# EAGLE design FZZSHAP_REVISED (EAGLE 9.2.2)
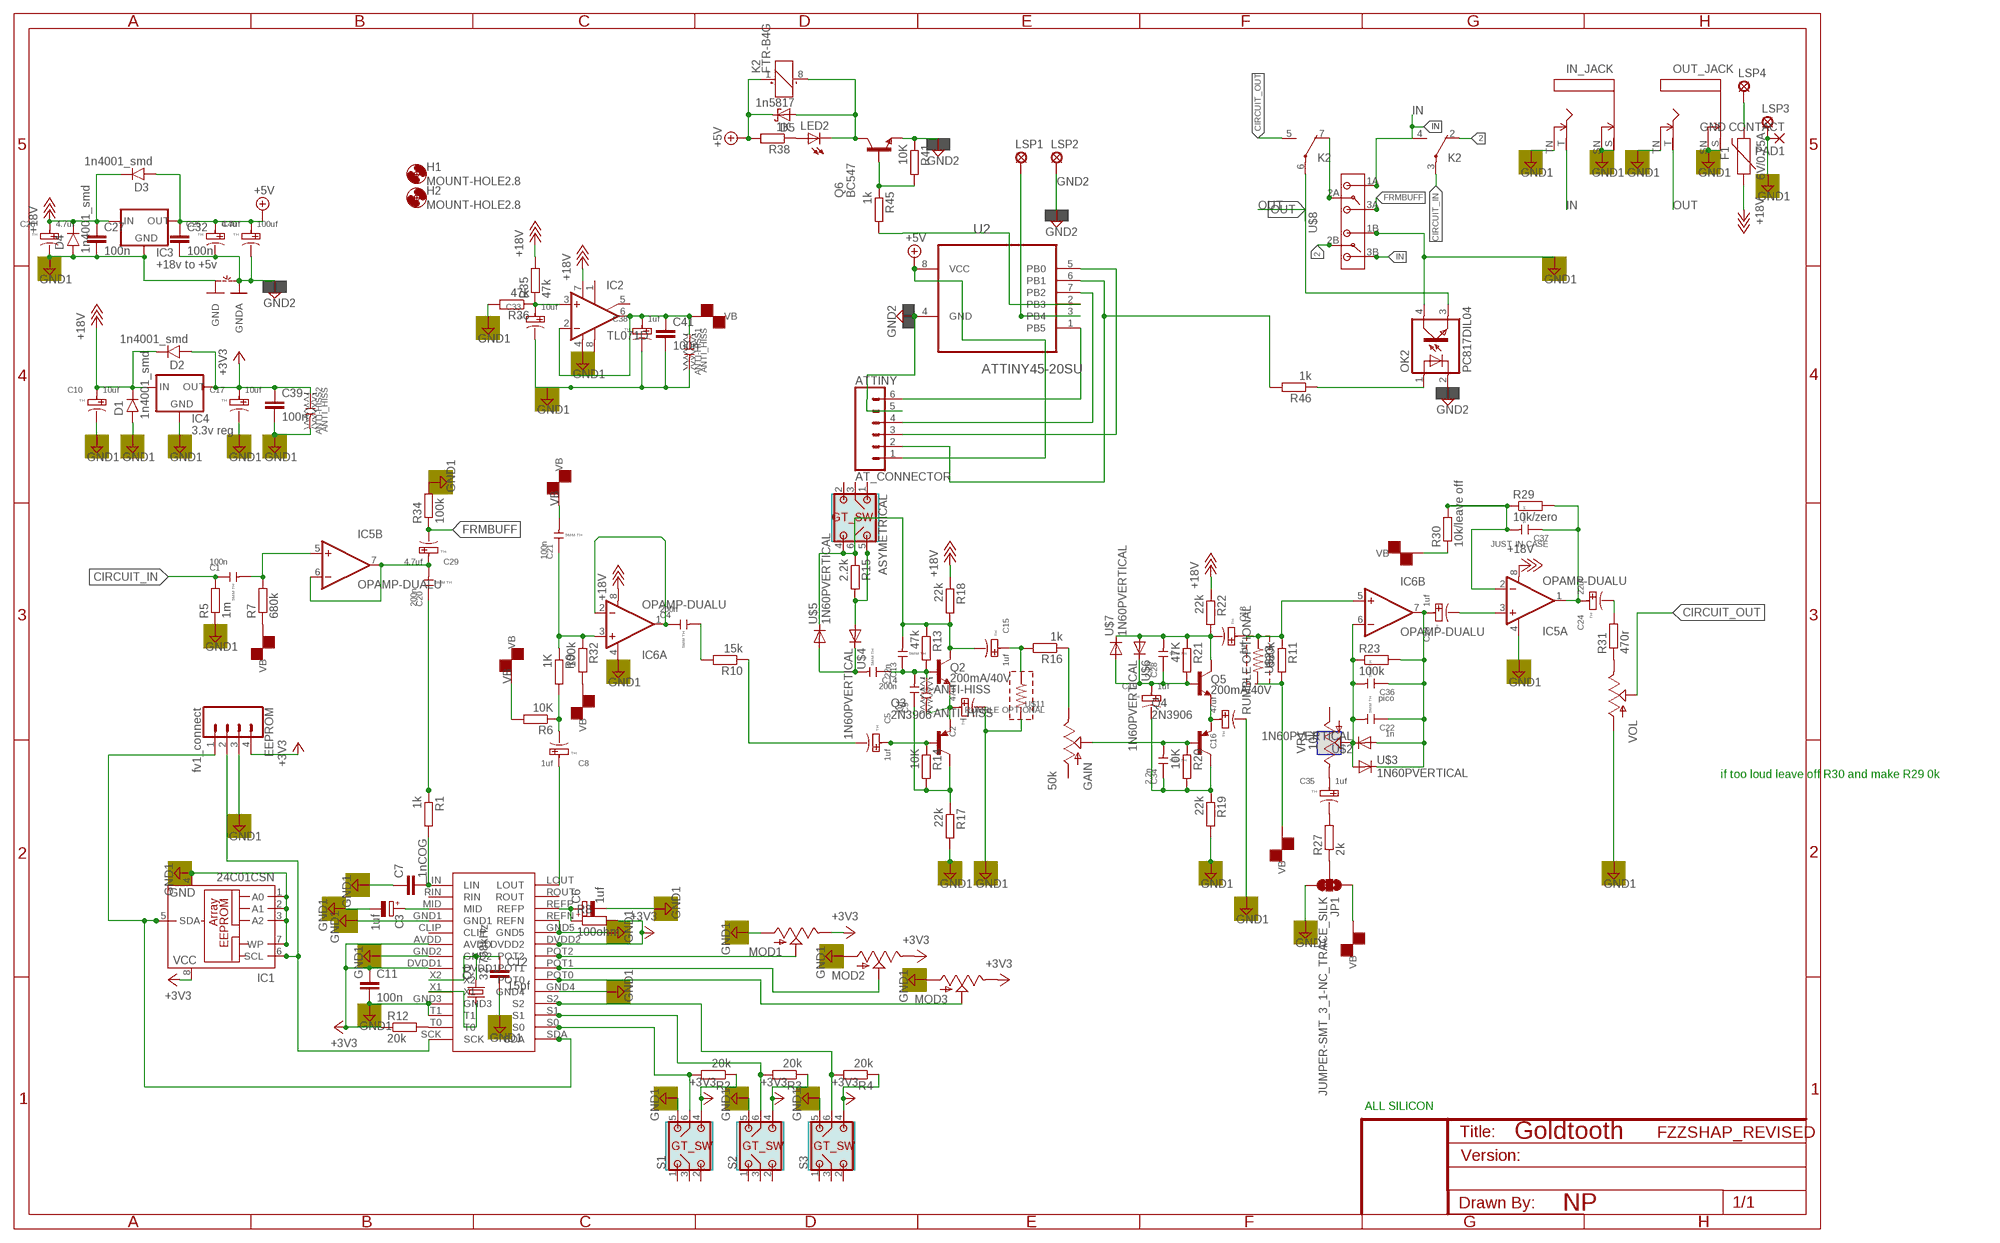
[diagram p0: schematic, sheet 1]

## Parts
ANTI-HISS  ANTI_HISS  SMDCERAMIC_1206_OPTIONAL  [SMD_OPTIONAL]
ANTI-HISS1  ANTI_HISS  SMDCERAMIC_1206_OPTIONAL  [SMD_OPTIONAL]
ANTI-HISS2  ANTI_HISS  SMDCERAMIC_1206_OPTIONAL  [SMD_OPTIONAL]
ASYMETRICAL  DP03SWPOT  [DP-03]
ATTINY  AT_CONNECTOR  CONN_06LONGPADS  [1X06_LONGPADS]
C1  100n  THRU_HOLE_5MM_SPACING  [CERAMIC-5MM]
C2  47uf  THRU-HOLE-POLARIZED  [PC-D5.3MM]
C3  1uf  CPOL-EUA/3216-18R  [A/3216-18R]
C4  200n  THRU_HOLE_5MM_SPACING  [CERAMIC-5MM]
C5  1uf  THRU-HOLE-POLARIZED  [PC-D5.3MM]
C6  1uf  CPOL-EUA/3216-18R  [A/3216-18R]
C7  1nCOG  C-EUC0805K  [C0805K]
C8  1uf  THRU-HOLE-POLARIZED  [PC-D5.3MM]
C9  1uf  THRU_HOLE_5MM_SPACING  [CERAMIC-5MM]
C10  10uf  THRU-HOLE-POLARIZED  [PC-D5.3MM]
C11  100n  C-EUC0805  [C0805]
C12  15pf  C-EUC0805  [C0805]
C13  22n  THRU_HOLE_5MM_SPACING  [CERAMIC-5MM]
C14  200n  THRU_HOLE_5MM_SPACING  [CERAMIC-5MM]
C15  1uf  THRU-HOLE-POLARIZED  [PC-D5.3MM]
C16  47uf  THRU-HOLE-POLARIZED  [PC-D5.3MM]
C17  10uf  THRU-HOLE-POLARIZED  [PC-D5.3MM]
C18  1uf  THRU-HOLE-POLARIZED  [PC-D5.3MM]
C19  1uf  THRU-HOLE-POLARIZED  [PC-D5.3MM]
C20  200n  THRU_HOLE_5MM_SPACING  [CERAMIC-5MM]
C21  100n  THRU_HOLE_5MM_SPACING  [CERAMIC-5MM]
C22  1n  THRU_HOLE_5MM_SPACING  [CERAMIC-5MM]
C23  1uf  THRU-HOLE-POLARIZED  [PC-D5.3MM]
C24  22uf  THRU-HOLE-POLARIZED  [PC-D5.3MM]
C25  4.7uf  THRU-HOLE-POLARIZED  [PC-D5.3MM]
C26  4.7uf  THRU-HOLE-POLARIZED  [PC-D5.3MM]
C27  100n  C-EUC1206  [C1206]
C28  2.2n  THRU_HOLE_5MM_SPACING  [CERAMIC-5MM]
C29  4.7uf  THRU-HOLE-POLARIZED  [PC-D5.3MM]
C32  100n  C-EUC1206  [C1206]
C33  10uf  THRU-HOLE-POLARIZED  [PC-D5.3MM]
C34  2.2n  THRU_HOLE_5MM_SPACING  [CERAMIC-5MM]
C35  1uf  THRU-HOLE-POLARIZED  [PC-D5.3MM]
C36  pico  THRU_HOLE_5MM_SPACING  [CERAMIC-5MM]
C37  JUST IN CASE  THRU_HOLE_5MM_SPACING  [CERAMIC-5MM]
C38  1uf  THRU-HOLE-POLARIZED  [PC-D5.3MM]
C39  100n  C-EUC1206  [C1206]
C40  100uf  THRU-HOLE-POLARIZED  [PC-D5.3MM]
C41  100n  C-EUC1206  [C1206]
D1  1n4001_smd  1N400X.1  [DO41-1]
D2  1n4001_smd  1N400X.1  [DO41-1]
D3  1n4001_smd  1N400X.1  [DO41-1]
D4  1n4001_smd  1N400X.1  [DO41-1]
D5  1n5817  SCHOTTKY-DIODESMD  [SMB]
EEPROM  fv1_connect  CONN_04LONGPADS  [1X04_LONGPADS]
F1  6V/0.75A  PPTC_THREE-QUARTER-AMP  [1206]
GAIN  50k  POTSLIDEY  [SLIDER_PAC]
H1  MOUNT-HOLE2.8  [2,8]
H2  MOUNT-HOLE2.8  [2,8]
IC1  24C01CSN  [SO-08]
IC2  TL071D  [SO08]
IC3  +18v to +5v  V_REG_78XX7812  [TO-252]
IC4  3.3v reg  78M33  [SOT223]
IC5  OPAMP-DUALU  [SO08]
IC6  OPAMP-DUALU  [SO08]
IN_JACK  MMMONNN  [MONO]
JP1  JUMPER-SMT_3_1-NC_TRACE_SILK  [SMT-JUMPER_3_1-NC_TRACE_SILK]
K2  FTR-B4G  [FTR-B4G]
LED2  LED3MM  [LED3MM]
LSP1  LSP10  [LSP10]
LSP2  LSP10  [LSP10]
LSP3  LSP10  [LSP10]
LSP4  LSP10  [LSP10]
MOD1  POTSLIDEY  [SLIDER_PAC]
MOD2  POTSLIDEY  [SLIDER_PAC]
MOD3  POTSLIDEY  [SLIDER_PAC]
OK2  PC817DIL04  [SMD4]
OUT_JACK  MMMONNN  [MONO]
PAD1  GND CONTACT  SMD5  [SMD2,54-5,08]
Q1  32.768kHz  CRYSTALTXC-7A  [CRYSTAL-TXC-7A]
Q2  200mA/40V  TRANS_NPN-2N3904  [TO-92]
Q3  2N3906  [TO92]
Q4  2N3906  [TO92]
Q5  200mA/40V  TRANS_NPN-2N3904  [TO-92]
Q6  BC547  [TO92]
R1  1k  R-EU_R1206  [R1206]
R2  20k  R-EU_R1206  [R1206]
R3  20k  R-EU_R1206  [R1206]
R4  20k  R-EU_R1206  [R1206]
R5  1m  R-EU_R1206  [R1206]
R6  10K  R-EU_R1206  [R1206]
R7  680k  R-EU_R1206  [R1206]
R8  100ohm  R-EU_R1206  [R1206]
R9  1K  R-EU_R1206  [R1206]
R10  15k  R-EU_R1206  [R1206]
R11  680k  R-EU_R1206  [R1206]
R12  20k  R-EU_R1206  [R1206]
R13  47k  R-EU_R1206  [R1206]
R14  10K  R-EU_R1206  [R1206]
R15  2.2k  R-EU_R1206  [R1206]
R16  1k  R-EU_R1206  [R1206]
R17  22k  R-EU_R1206  [R1206]
R18  22k  R-EU_R1206  [R1206]
R19  22k  R-EU_R1206  [R1206]
R20  10K  R-EU_R1206  [R1206]
R21  47K  R-EU_R1206  [R1206]
R22  22k  R-EU_R1206  [R1206]
R23  100k  R-EU_R1206  [R1206]
R27  2k  R-EU_R1206  [R1206]
R29  10k/zero  R-EU_R1206  [R1206]
R30  10k/leave off  R-EU_R1206  [R1206]
R31  470r  R-EU_R1206  [R1206]
R32  100k  R-EU_R1206  [R1206]
R34  100k  R-EU_R1206  [R1206]
R35  47k  R-EU_R1206  [R1206]
R36  47k  R-EU_R1206  [R1206]
R38  1K  R-EU_M1206  [M1206]
R41  10K  R-EU_M1206  [M1206]
R45  1k  R-EU_M1206  [M1206]
R46  1k  R-EU_M1206  [M1206]
S1  DP03SWPOT  [DP-03]
S2  DP03SWPOT  [DP-03]
S3  DP03SWPOT  [DP-03]
U2  ATTINY45-20SU  [SOIC127P798X216-8N]
U$1  FV-1SOIC28  [SOIC28]
U$2  1N60PVERTICAL  [DO41-1]
U$3  1N60PVERTICAL  [DO41-1]
U$4  1N60PVERTICAL  [DO41-1]
U$5  1N60PVERTICAL  [DO41-1]
U$6  1N60PVERTICAL  [DO41-1]
U$7  1N60PVERTICAL  [DO41-1]
U$8  BYSWITCH  [BUFF/TRBYPASS]
U$11  RUMBLE OPTIONAL  SMD_TOPTIONAL_RESISTOR_1206  [C1206]
U$23  RUMBLE OPTIONAL  SMD_TOPTIONAL_RESISTOR_1206  [C1206]
VOL  POTSLIDEY  [SLIDER_PAC]
VR1  10k  TRIM_US-3223G  [3223G]
~NUDEV~1  GND-GNDA1,27MM  [GND-GNDA-1,27MM]

## Nets
2: K2.2(-1:O) U$8.2B
+3V3: ANTI-HISS2.1 C11.1 C17.+ C39.1 D2.A EEPROM.4 IC1.8(VCC) IC4.3(OUT) MOD1.3(E) MOD2.3(E) MOD3.3(E) R2.1 R3.1 R4.1 R8.2 R12.1 S1.4 S2.4 S3.4 U$1.AVDD U$1.DVDD1 U$1.DVDD2
+5V: ATTINY.1 C25.+ C32.1 C40.+ D3.A D5.C IC3.2(OUT) K2.1(K:+) R38.2 U2.8(VCC)
+18V: C10.+ C26.+ C27.1 D1.C D2.C D3.C D4.C F1.1 IC2.7(V+) IC3.1(IN) IC4.1(IN) IC5.8(A:V+) IC6.8(A:V+) R18.1 R22.1 R35.2
CIRCUIT_IN: C1.1 K2.3(-1:P) R5.2
CIRCUIT_OUT: K2.5(-2:S) VOL.2(S)
FRMBUFF: C29.- R34.1 U$8.3A
FV-1_SW_1: R2.2 S1.6 U$1.S0
FV-1_SW_2: R3.2 S2.6 U$1.S1
FV-1_SW_3: R4.2 S3.6 U$1.S2
GND1: ANTI-HISS1.2 ANTI-HISS2.2 C2.- C3.- C6.- C7.1 C10.- C11.2 C12.2 C16.- C17.- C26.- C27.2 C33.- C38.- C39.2 C41.2 D1.A D4.A EEPROM.3 IC1.1(A0) IC1.2(A1) IC1.3(A2) IC1.4(GND) IC1.7(WP) IC2.4(V-) IC3.3(GND) IC4.2(GND) IC4.4(GND) IC5.4(A:V-) IC6.4(A:V-) IN_JACK.S IN_JACK.SN IN_JACK.TN JP1.3 LSP3.MP MOD1.1(A) MOD2.1(A) MOD3.1(A) OK2.4(COL) OUT_JACK.S OUT_JACK.SN OUT_JACK.TN PAD1.1(P) R5.1 R17.2 R19.2 R34.2 R36.2 S1.5 S2.5 S3.5 U$1.GND1 U$1.GND2 U$1.GND3 U$1.GND4 U$1.GND5 U$1.REFN U$1.T1 U$8.1B U$11.2 VOL.1(A) ~NUDEV~1.GND
GND2: ATTINY.5 C25.- C32.2 C40.- LSP2.MP OK2.2(C) Q6.1(E) R41.1 U2.4(GND) ~NUDEV~1.GNDA
IN: IN_JACK.T K2.4(-1:S) U$8.1A U$8.3B
LEFT_IN: C20.1 R1.1
LEFT_OUT: C8.+ U$1.LOUT
N$1: C5.+ Q3.2(B) R14.1
N$2: MOD3.2(S) U$1.POT0
N$3: C8.- R6.1 R9.2
N$4: C15.+ R16.2 U$11.1
N$5: C1.2 IC5.5(B:+IN) R7.2
N$6: C4.2 R10.2
N$7: C5.- R10.1
N$8: C21.1 IC6.3(A:+IN) R9.1 R32.1
N$10: C4.1 IC6.1(A:OUT) IC6.2(A:-IN)
N$11: ASYMETRICAL.5 R15.2 U$4.A
N$12: C37.2 IC5.2(A:-IN) R29.1 R30.2
N$13: C35.+ VR1.3(E)
N$14: MOD2.2(S) U$1.POT1
N$15: ANTI-HISS.2 C2.+ Q2.1(E) Q3.3(E)
N$16: ASYMETRICAL.4 ASYMETRICAL.6 C13.2 C15.- Q2.3(C) R13.1 R15.1 R18.2 U$5.C
N$17: GAIN.3(E) R16.1
N$18: C9.1 Q3.1(C) R14.2 R17.1
N$19: MOD1.2(S) U$1.POT2
N$21: C18.+ IC6.5(B:+IN) R11.1 U$23.1
N$22: C23.- IC5.3(A:+IN)
N$23: C22.1 C23.+ C36.1 IC6.7(B:OUT) R23.2 U$2.A U$3.C
N$24: C35.- R27.2
N$25: C16.+ Q4.3(E) Q5.1(E)
N$26: EEPROM.2 IC1.6(SCL) U$1.SCK
N$27: C24.+ C37.1 IC5.1(A:OUT) R29.2
N$28: EEPROM.1 IC1.5(SDA) U$1.SDA
N$29: C34.2 GAIN.2(S) Q4.2(B) R20.1
N$30: C7.2 R1.2 U$1.LIN
N$31: C19.+ C28.1 Q5.2(B) R21.2 U$6.C U$7.A
N$32: C14.2 U$4.C U$5.A
N$33: C3.+ U$1.MID
N$34: F1.2 LSP4.MP
N$35: C19.- C34.1 Q4.1(C) R19.1 R20.2
N$36: C24.- R31.2
N$37: JP1.2 R27.1
N$38: C22.2 C36.2 IC6.6(B:-IN) R23.1 U$2.C U$3.A VR1.2(S)
N$39: C33.+ IC2.3(+IN) R35.1 R36.1
N$40: ANTI-HISS.1 C9.2 C13.1 C14.1 Q2.2(B) R13.2
N$41: C20.2 C29.+ IC5.6(B:-IN) IC5.7(B:OUT)
N$43: R31.1 VOL.3(E)
N$46: C6.+ R8.1 U$1.REFP
N$51: C18.- C28.2 Q5.3(C) R21.1 R22.2 U$6.A U$7.C
N$52: R12.2 U$1.T0
N$53: C12.1 Q1.P$2 U$1.X2
N$54: Q1.P$1 U$1.X1
N$59: K2.7(-2:O) U$8.2A
N$74: ATTINY.3 U2.5(PB0)
N$75: ATTINY.2 R46.2 U2.6(PB1)
N$76: ATTINY.4 U2.7(PB2)
N$77: ATTINY.6 U2.1(PB5)
N$78: LED2.A R38.1
N$79: D5.A K2.8(K:-) LED2.K(C) Q6.3(C)
N$84: Q6.2(B) R41.2 R45.1
N$85: R45.2 U2.2(PB3)
N$87: LSP1.MP U2.3(PB4)
N$88: OK2.1(A) R46.1
OUT: K2.6(-2:P) OK2.3(EMIT) OUT_JACK.T
VB: ANTI-HISS1.1 C21.2 C38.+ C41.1 IC2.2(-IN) IC2.6(OUT) JP1.1 R6.2 R7.1 R11.2 R30.1 R32.2 U$23.2
Unconnected: ASYMETRICAL.1 ASYMETRICAL.2 ASYMETRICAL.3 GAIN.1(A) IC2.1(ON1) IC2.5(ON2) IC2.8(OPT) S1.1 S1.2 S1.3 S2.1 S2.2 S2.3 S3.1 S3.2 S3.3 U$1.CLIP U$1.RIN U$1.ROUT VR1.1(A)

## Notes on the sheet
- if too loud leave off R30 and make R29 0k
- ALL SILICON

## Library data of the parts
ANTI-HISS ANTI-HISS1 ANTI-HISS2 = GT_Capacitor:SMDCERAMIC_1206_OPTIONAL
ASYMETRICAL S1-S3 = switch-dil:DP03: DIL/CODE SWITCH
ATTINY = GT_Connectors:CONN_06: Multi connection point. Often used as Generic Header-pin footprint for 0.1 inch spaced/style header connections On any of the 0.1 inch spaced packages, you can populate with these: Break Away Headers - Straight <https://www.sparkfun.com/products/116> (PRT-00116) Break Away Male Headers - Right Angle <https://www.sparkfun.com/products/553> (PRT-00553) Female Headers <https://www.sparkfun.com/products/115> (PRT-00115) Break Away Headers - Machine Pin <https://www.sparkfun.com/products/117> (PRT-00117) Break Away Female Headers - Swiss Machine Pin <https://www.sparkfun.com/products/743> (PRT-00743) Arduino Stackable Header - 6 Pin <https://www.sparkfun.com/products/9280> (PRT-09280) For SCREWTERMINALS and SPRING TERMINALS visit here: Screw Terimnals on SparkFun.com <https://www.sparkfun.com/search/results?term=Screw+Terminals> (5mm/3.5mm/2.54mm spacing) This device is also useful as a general connection point to wire up your design to another part of your project. Our various solder wires solder well into these plated through hole pads. Hook-Up Wire - Assortment (Stranded, 22 AWG) <https://www.sparkfun.com/products/11375> (PRT-11375) Hook-Up Wire - Assortment (Solid Core, 22 AWG) <https://www.sparkfun.com/products/11367> (PRT-11367) View the entire wire category on our website here <https://www.sparkfun.com/categories/141>
C1 C4 C9 C13 C14 C20-C22 C28 C34 C36 C37 = GT_Capacitor:THRU_HOLE_5MM_SPACING: 302010202; PACKAGE: 5MM TH
C2 C5 C8 C10 C15-C19 C23-C26 C29 C33 C35 C38 C40 = GT_Capacitor:THRU-HOLE-POLARIZED: 302030033; PACKAGE: TH
C3 C6 = resistor:CPOL-EU: POLARIZED CAPACITOR, European symbol
C7 C11 C12 C27 C32 C39 C41 = resistor:C-EU: CAPACITOR, European symbol
D1-D4 = gm-diodes:1N400X: Rectifier Diodes often used in power supply to prevent damage from reverse polarization
D5 = diode:SCHOTTKY-DIODE: Schottky Diode
EEPROM = GT_Connectors:CONN_04: Multi connection point. Often used as Generic Header-pin footprint for 0.1 inch spaced/style header connections On any of the 0.1 inch spaced packages, you can populate with these: Break Away Headers - Straight <https://www.sparkfun.com/products/116> (PRT-00116) Break Away Male Headers - Right Angle <https://www.sparkfun.com/products/553> (PRT-00553) Female Headers <https://www.sparkfun.com/products/115> (PRT-00115) Break Away Headers - Machine Pin <https://www.sparkfun.com/products/117> (PRT-00117) Break Away Female Headers - Swiss Machine Pin <https://www.sparkfun.com/products/743> (PRT-00743) For SCREWTERMINALS and SPRING TERMINALS visit here: Screw Terimnals on SparkFun.com <https://www.sparkfun.com/search/results?term=Screw+Terminals> (5mm/3.5mm/2.54mm spacing) This device is also useful as a general connection point to wire up your design to another part of your project. Our various solder wires solder well into these plated through hole pads. Hook-Up Wire - Assortment (Stranded, 22 AWG) <https://www.sparkfun.com/products/11375> (PRT-11375) Hook-Up Wire - Assortment (Solid Core, 22 AWG) <https://www.sparkfun.com/products/11367> (PRT-11367) View the entire wire category on our website here <https://www.sparkfun.com/categories/141> Special notes: Molex polarized connector foot print use with SKU : PRT-08231 with associated crimp pins and housings. 1MM SMD Version SKU: PRT-10208; PROD_ID: CONN-09696
F1 = GOLDTOOTH-Fuses:PPTC: Resettable Fuse PPTC Resettable Fuse. Really a sort of resistor with a polymeric positive temperature coefficient whose resistance increases dramatically with an increase in temperature. When heated by the power passing through the resistance rises causing the current to be limited, protecting the circuit. This is achieved by the transition of the polymer from a crystalline to an amorphous state where the conductive carbon separates breaking the conductive pathways found in the cool crystalline structure. When a PPTC cools back down it resumes conducting letting the circuit turn back on. SparkFun Products: SparkFun RedBoard - Programmed with Arduino <https://www.sparkfun.com/products/12757> Pro Micro - 5V/16MHz <https://www.sparkfun.com/products/12640> Arduino Pro 328 - 5V/16MHz <https://www.sparkfun.com/products/10915> MP3 Trigger <https://www.sparkfun.com/products/13720>; PROD_ID: RES-11150
GAIN MOD1-MOD3 VOL = SparkFun-Electromechanical:POT
H1 H2 = holes:MOUNT-HOLE: MOUNTING HOLE with drill center marker
IC1 = microchip:24C*: Serial EEPROM 1 K/2 K/4 K; MF: MICROCHIP; MPN: 24C01C/SN; OC_FARNELL: unknown; OC_NEWARK: 96K4061
IC2 = linear:TL071: OP AMP
IC3 = SparkFun-IC-Power:V_REG_78XX: Voltage Regulator Standard 78xx regulator. IGO (Input Ground Output). Spark Fun Electronics SKU : COM-00107; PROD_ID: VREG-12370; VALUE: +12v
IC4 = v-reg-2:78M33
IC5 IC6 = SparkFun-AnalogIC:OPAMP-DUAL: Generic op-amp footprint
IN_JACK = gm-jacks2:MMMONNN; SPICEPREFIX: E
JP1 = SparkFun-Jumpers:JUMPER-SMT_3_1-NC_TRACE: Normally closed trace jumper (1 of 2 connections) This jumper has a trace between two pads so it's normally closed (NC). The other connection is normally open (NO). Use a razor knife to open the connection. For best results follow the IPC guidelines for cutting traces: Cutout at least 0.063 mm (0.005 in). Remove all loose material to clean up the cut area. Seal the cut with an approved epoxy. Reapply solder to reclose the connection, or to close the NO connection.
K2 = relay:FTR-B4: ULTRA MINIATURE RELAY 2 POLES - 2 A (Slim Profile Signal Relay) FUJITSU FTR-B4 SERIES Source: FTR-B4.pdf
LED2 = GOLDTOOTH_LED:LED: LED OSRAM: - CHIPLED LG R971, LG N971, LY N971, LG Q971, LY Q971, LO R971, LY R971 LH N974, LH R974 LS Q976, LO Q976, LY Q976 LO Q996 - Hyper CHIPLED LW Q18S LB Q993, LB Q99A, LB R99A - SideLED LS A670, LO A670, LY A670, LG A670, LP A670 LB A673, LV A673, LT A673, LW A673 LH A674 LY A675 LS A676, LA A676, LO A676, LY A676, LW A676 LS A679, LY A679, LG A679 - Hyper Micro SIDELED® LS Y876, LA Y876, LO Y876, LY Y876 LT Y87S - SmartLED LW L88C, LW L88S LB L89C, LB L89S, LG L890 LS L89K, LO L89K, LY L89K LS L896, LA L896, LO L896, LY L896 - TOPLED LS T670, LO T670, LY T670, LG T670, LP T670 LSG T670, LSP T670, LSY T670, LOP T670, LYG T670 LG T671, LOG T671, LSG T671 LB T673, LV T673, LT T673, LW T673 LH T674 LS T676, LA T676, LO T676, LY T676, LB T676, LH T676, LSB T676, LW T676 LB T67C, LV T67C, LT T67C, LS T67K, LO T67K, LY T67K, LW E67C LS E67B, LA E67B, LO E67B, LY E67B, LB E67C, LV E67C, LT E67C LW T67C LS T679, LY T679, LG T679 LS T770, LO T770, LY T770, LG T770, LP T770 LB T773, LV T773, LT T773, LW T773 LH T774 LS E675, LA E675, LY E675, LS T675 LS T776, LA T776, LO T776, LY T776, LB T776 LHGB T686 LT T68C, LB T68C - Hyper Mini TOPLED® LB M676 - Mini TOPLED Santana® LG M470 LS M47K, LO M47K, LY M47K Source: http://www.osram.convergy.de LUXEON: - LUMILED® LXK2-PW12-R00, LXK2-PW12-S00, LXK2-PW14-U00, LXK2-PW14-V00 LXK2-PM12-R00, LXK2-PM12-S00, LXK2-PM14-U00 LXK2-PE12-Q00, LXK2-PE12-R00, LXK2-PE12-S00, LXK2-PE14-T00, LXK2-PE14-U00 LXK2-PB12-K00, LXK2-PB12-L00, LXK2-PB12-M00, LXK2-PB14-N00, LXK2-PB14-P00, LXK2-PB14-Q00 LXK2-PR12-L00, LXK2-PR12-M00, LXK2-PR14-Q00, LXK2-PR14-R00 LXK2-PD12-Q00, LXK2-PD12-R00, LXK2-PD12-S00 LXK2-PH12-R00, LXK2-PH12-S00 LXK2-PL12-P00, LXK2-PL12-Q00, LXK2-PL12-R00 Source: www.luxeon.com KINGBRIGHT: KA-3528ASYC Source: www.kingbright.com
LSP1-LSP4 = solpad:LSP10: SOLDER PAD drill 1.0 mm, distributor Buerklin, 12H555
OK2 = GT_optocoupler:PC817: SHARP OPTO COUPLER
OUT_JACK = gm-jacks2:MMMONNN
PAD1 = wirepad:SMD5: SMD PAD
Q1 = SparkFun-FreqCtrl:CRYSTAL: Various standard crystals. Proven footprints. Spark Fun Electronics SKU : COM-00534
Q2 Q5 = SparkFun-DiscreteSemi:TRANS_NPN: NPN transistor Current controlled devices typically used to amplify current or used as a switch. BC547 - COM-08928 <http://www.sparkfun.com/products/8928> (TO-92 45V 100mA) (1.Collector 2.Base 3.Emitter) 2N3904 - COM-00521 <http://www.sparkfun.com/products/521> (TO-92 40V 200mA) (1.Emitter 2.Base 3.Collector) P2N2222A - COM-12852 <http://www.sparkfun.com/products/12852> (TO-92 40V 600mA) (1.Collector 2.Base 3.Emitter); PROD_ID: TRANS-08447
Q3 Q4 = transistor-pnp:2N3906: PNP Transistor
Q6 = transistor-npn:BC547*: NPN Transistor
R1-R23 R27 R29-R32 R34-R36 R38 R41 R45 R46 = resistor:R-EU_: RESISTOR, European symbol
U2 = Atmel_By_element14_Batch_1-00:ATTINY45-20SU: 8-bit Microcontroller with 4 Bytes In-System Programmable Flash; MPN: ATTINY45-20SU; OC_FARNELL: 1288353; OC_NEWARK: 23M5073; PACKAGE: SOIC-8; SUPPLIER: Atmel
U$1 = spinsemi:FV-1
U$2-U$7 = diode:1N60P
U$8 = switch-dil:BYSWITCH
U$11 U$23 = GT_Capacitor:SMD_TOPTIONAL_RESISTOR_1206
VR1 = pot:TRIM_US-: POTENTIOMETER
~NUDEV~1 = ground-junctions:GND-GNDA: Connect GND - GNDA without DRC-Error, display layer 53 (54) to make copper (ROUTE) from GND to GNDA Select also layer 53 (54) in CAM-Job!

## Board
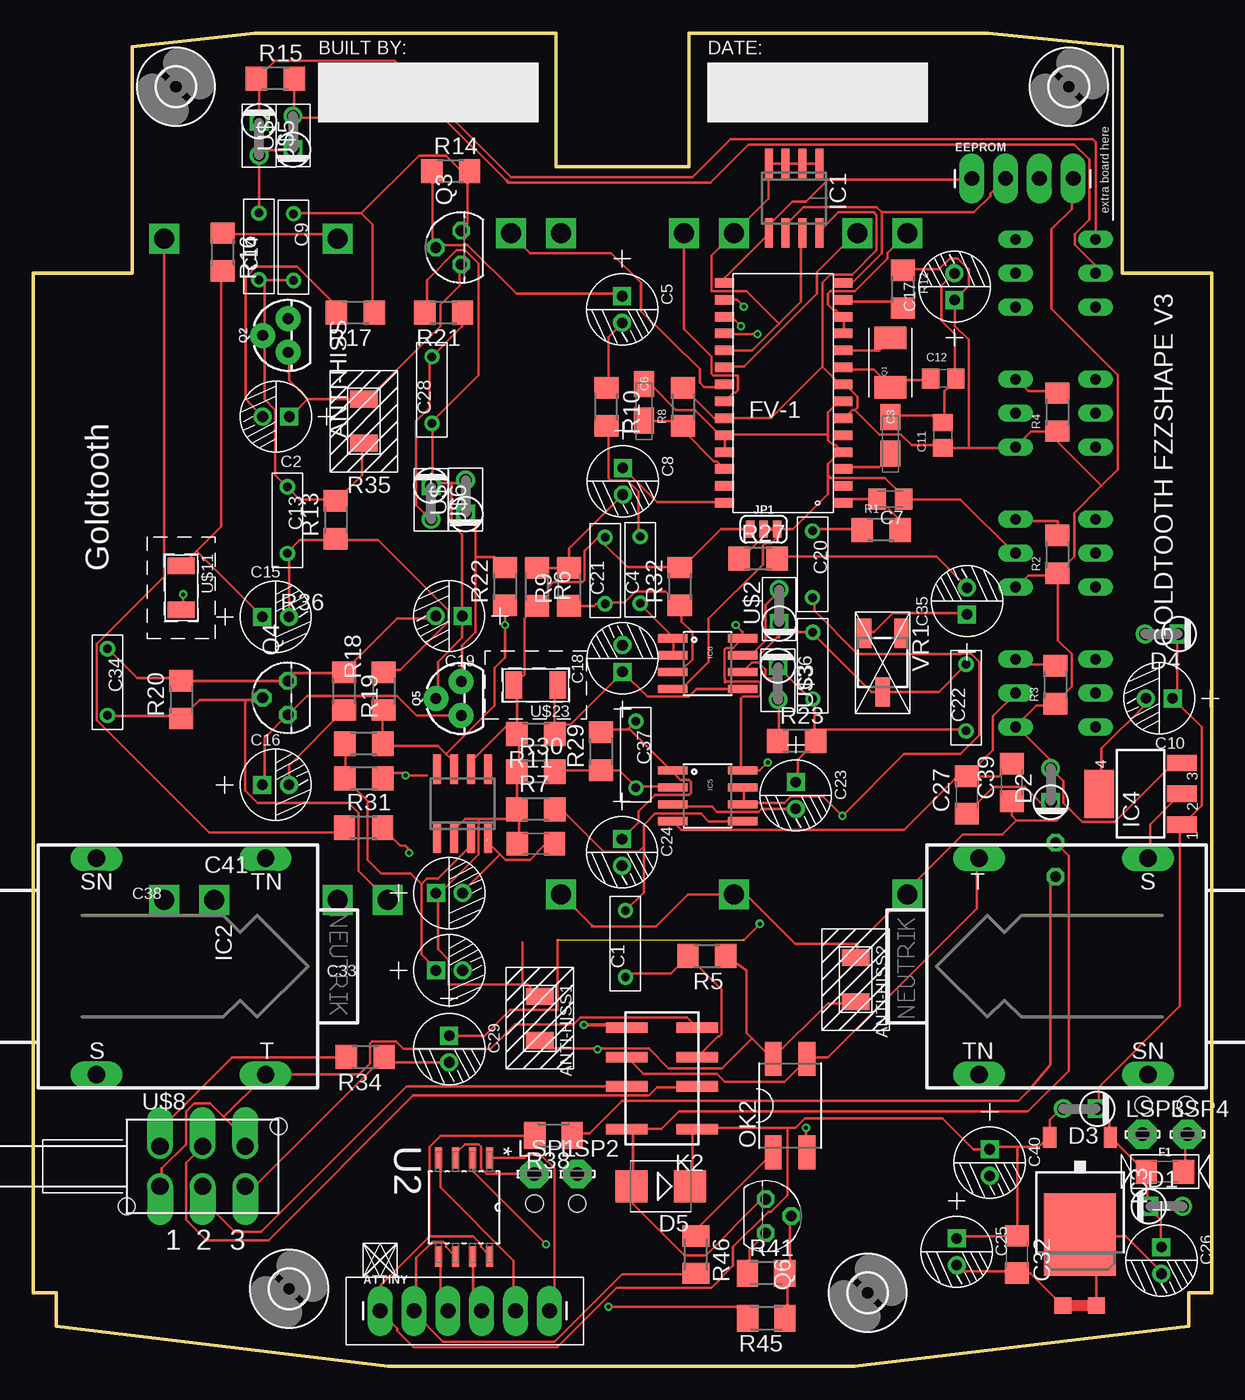
[diagram p1: board, top side]
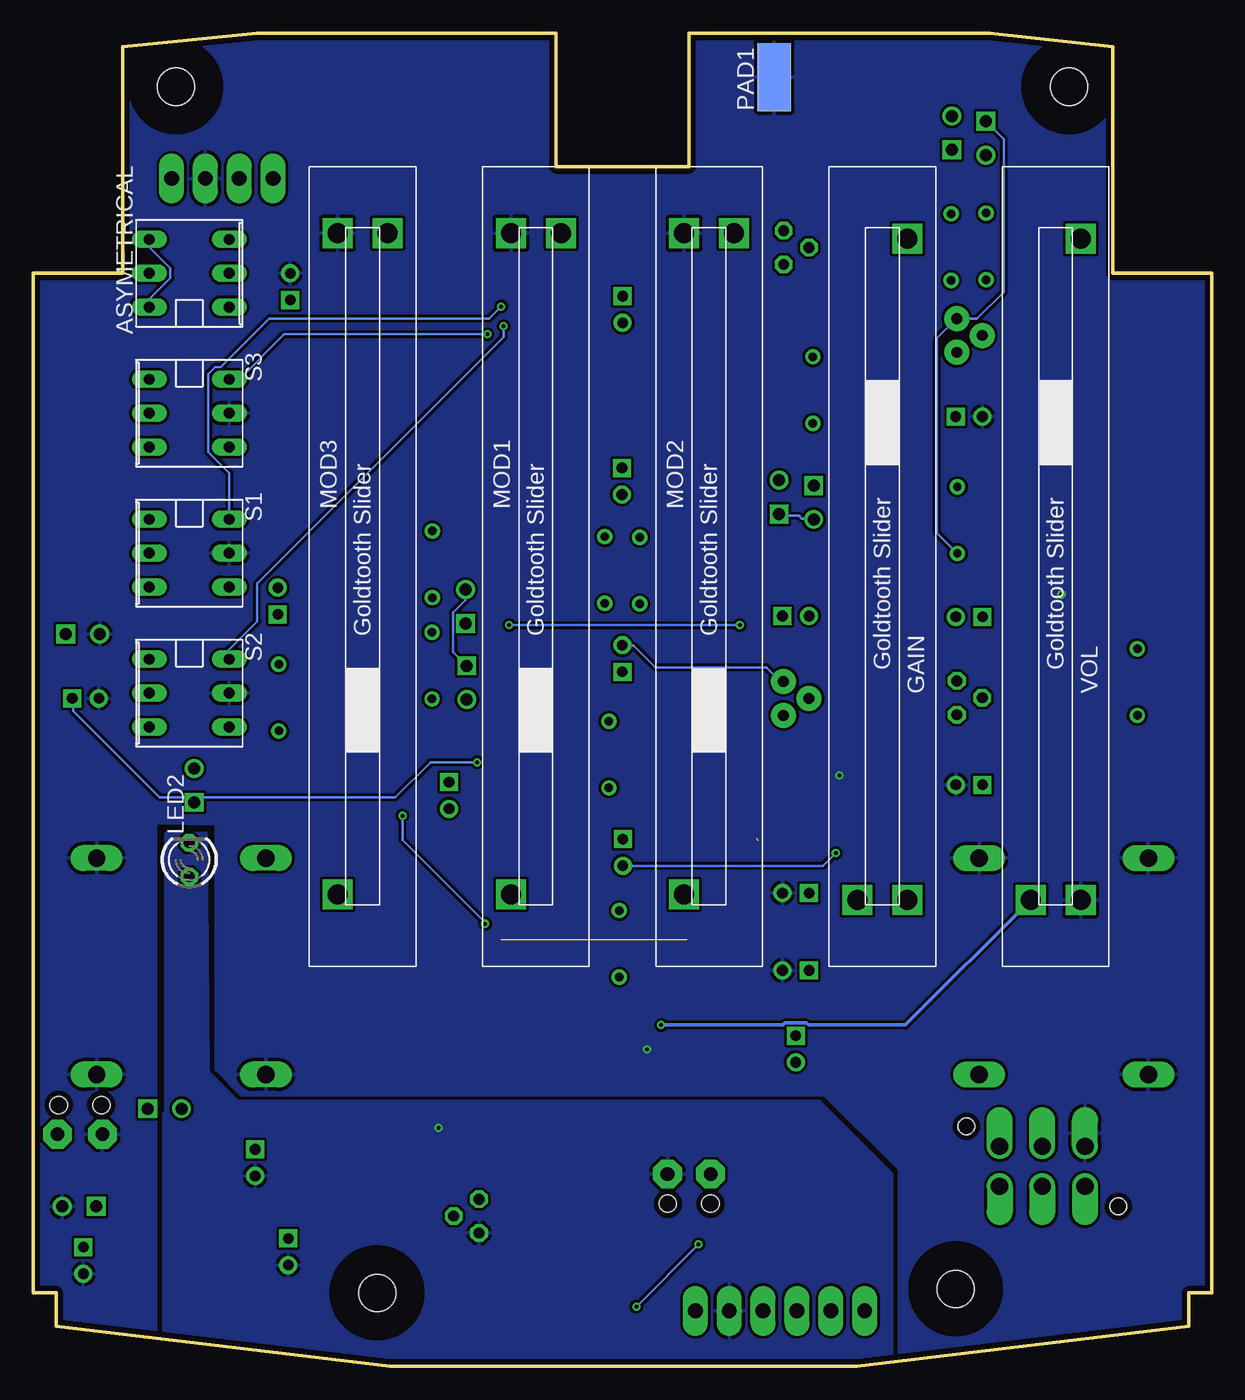
[diagram p2: board, bottom side, seen from below]

Size 88.4 x 100 mm. Coordinates in mm from the lower left corner, seen from the top.
Outline: 0,82 0,5.5 1.7,5.5 1.7,3 26.62,0 61.62,0 86.7,3 86.7,5.5 88.4,5.5 88.4,82 81.7,82 81.7,99 71.62,100 49.2,100 49.2,90 39.2,90 39.2,100 16.62,100 7.4,99 7.4,82 0,82
Copper layers (1*16): Top 0.035mm / dielectric 1.5mm / Bottom 0.035mm
Design rules "GT *": minimum track width 8mil, minimum drill 0.3mm, track to track 8mil, track to pad 6mil, pad to pad 6mil, via to via 6mil, smd to smd 0mil, copper to edge 0.4mm, drill to drill 10mil, minimum pad ring 10mil, minimum via ring 6mil, stop-mask expansion 2mil, vias tented up to drill 25mil, thermal gap 10mil

### Footprints (pad centres in the part's own frame; a part is rotated, then mirrored left to right if it is on the bottom)
SMD_OPTIONAL = smd 1.27 x 2.032: 1 -1.651,0; 2 1.651,0
DP-03 = drill 0.813 long: 1 -2.54,-3; 2 0,-3; 3 2.54,-3; 4 2.54,3; 5 0,3; 6 -2.54,3
1X06_LONGPADS = drill 1.118 pad 1.88 long: 1 0,0; 2 2.54,0; 3 5.08,0; 4 7.62,0; 5 10.16,0; 6 12.7,0
CERAMIC-5MM = drill 0.635 pad 1.143: 1 -2.5,0; 2 2.5,0
PC-D5.3MM = drill 0.8 pad 1.35 square: + -1,0 | drill 0.8 pad 1.35: - 1,0
A/3216-18R = smd 1.95 x 1.5: + 1.375,0; - -1.375,0
C0805K = smd 1.3 x 1.6: 1 -1,0; 2 1,0
C0805 = smd 1.3 x 1.5: 1 -0.95,0; 2 0.95,0
C1206 = smd 1.6 x 1.8: 1 -1.4,0; 2 1.4,0
DO41-1 = drill 0.9: A 1.27,0 | drill 0.9 square: C -1.27,0
SMB = smd 2.4 x 2.4: A 2.2,0; C -2.2,0
1X04_LONGPADS = drill 1.118 pad 1.88 long: 1 0,0; 2 2.54,0; 3 5.08,0; 4 7.62,0
1206 = smd 1.6 x 1.8: 1 -1.4,0; 2 1.4,0
SLIDER_PAC = drill 1.5 square: 1 -25,-1.875; 2 -25,1.875; 3 24.6,-1.875
2,8 = hole 2.8: 0,0
SO-08 = smd 0.6 x 2.2: 1 -1.905,-2.6; 2 -0.635,-2.6; 3 0.635,-2.6; 4 1.905,-2.6; 5 1.905,2.6; 6 0.635,2.6; 7 -0.635,2.6; 8 -1.905,2.6
SO08 = smd 0.6 x 2.2: 1 -1.905,-2.6; 2 -0.635,-2.6; 3 0.635,-2.6; 4 1.905,-2.6; 5 1.905,2.6; 6 0.635,2.6; 7 -0.635,2.6; 8 -1.905,2.6
TO-252 = smd 1 x 1.6: 1 -2.28,-4.8; 2 2.28,-4.8 | smd 5.4 x 6.2: 3 0,2.5
SOT223 = smd 1.219 x 2.235: 1 -2.311,-3.099; 2 0,-3.099; 3 2.311,-3.099 | smd 3.6 x 2.2: 4 0,3.099
SO08' = smd 0.61 x 2.21: 1 -1.905,-2.616; 2 -0.635,-2.616; 3 0.635,-2.616; 4 1.905,-2.616; 5 1.905,2.616; 6 0.635,2.616; 7 -0.635,2.616; 8 -1.905,2.616
MONO = drill 1.3 long: S 6.35,8.115; SN 6.35,-8.115; T -6.35,8.115; TN -6.35,-8.115
SMT-JUMPER_3_1-NC_TRACE_SILK = smd 0.635 x 1.27: 1 -1.016,0; 2 0,0; 3 1.016,0
FTR-B4G = smd 0.8 x 3.1: 1 -3.8,-2.65; 2 -0.6,-2.65; 3 1.6,-2.65; 4 3.8,-2.65; 5 3.8,2.65; 6 1.6,2.65; 7 -0.6,2.65; 8 -3.8,2.65
LED3MM = drill 0.813 octagon: A -1.27,0; K 1.27,0
LSP10 = drill 1.016 pad 2.159 octagon: MP 0,0
SMD4 = smd 1.27 x 2.54: 1 -1.27,-3.5; 2 1.27,-3.5; 3 1.27,3.5; 4 -1.27,3.5
SMD2,54-5,08 = smd 2.54 x 5.08: 1 0,0
CRYSTAL-TXC-7A = smd 1.7 x 2.4: P$1 1.85,0; P$2 -1.85,0
TO-92 = drill 0.813 pad 1.88: 1 -1.27,0; 2 0,1.905; 3 1.27,0
TO92 = drill 0.813 octagon: 1 1.27,0; 2 0,1.905; 3 -1.27,0
R1206 = smd 1.6 x 1.803: 1 -1.422,0; 2 1.422,0
M1206 = smd 1.6 x 2: 1 -1.4,0; 2 1.4,0
SOIC127P798X216-8N = smd 1.549 x 0.533: 1 -3.708,1.905; 2 -3.708,0.635; 3 -3.708,-0.635; 4 -3.708,-1.905; 5 3.708,-1.905; 6 3.708,-0.635; 7 3.708,0.635; 8 3.708,1.905
SOIC28 = smd 1.422 x 0.711: AVDD -4.445,1.27; CLIP -4.445,2.54; DVDD1 -4.445,-1.27; DVDD2 4.445,1.27; GND1 -4.445,3.81; GND2 -4.445,0; GND3 -4.445,-5.08; GND4 4.445,-3.81; GND5 4.445,2.54; LIN -4.445,7.62; LOUT 4.445,7.62; MID -4.445,5.08; POT0 4.445,-2.54; POT1 4.445,-1.27; POT2 4.445,0; REFN 4.445,3.81; REFP 4.445,5.08; RIN -4.445,6.35; ROUT 4.445,6.35; S0 4.445,-7.62; S1 4.445,-6.35; S2 4.445,-5.08; SCK -4.445,-8.89; SDA 4.445,-8.89; T0 -4.445,-7.62; T1 -4.445,-6.35; X1 -4.445,-3.81; X2 -4.445,-2.54
BUFF/TRBYPASS = drill 1.3 offset: 1A -3.2,-1.5; 1B -3.2,1.5; 2A 0,-1.5; 2B 0,1.5; 3A 3.2,-1.5; 3B 3.2,1.5 | hole 1.25: -5.7,-3; 5.7,3
C1206' = smd 1.27 x 2.032: 1 -1.651,0; 2 1.651,0
HOLD = hole 1.3: 0,0
3223G = smd 2.184 x 1.067: 1 -2.2,1.4; 2 2.2,0; 3 -2.2,-1.4
GND-GNDA-1,27MM = smd 1.27 x 1.27: GND -1.27,0; GNDA 1.27,0

### Placement (x,y rotation side)
ANTI-HISS  24.8,70.9 90 top
ANTI-HISS1  38,26.1 270 top
ANTI-HISS2  61.7,29 270 top
ASYMETRICAL  76.7,82 90 bottom
ATTINY  26.02,4.14 0 top
C1  44.43,31.69 90 top
C2  18.2,71.24 180 top
C3  64.31,69.85 270 top
C4  45.53,59.74 90 top
C5  44.19,79.28 270 top
C6  45.82,72.31 270 top
C7  64.31,65.06 180 top
C8  44.23,66.39 270 top
C9  19.53,83.96 270 top
C10  84.48,50.1 180 top
C11  68.24,69.85 90 top
C12  68.27,74.11 0 top
C13  19.07,63.48 270 top
C14  16.92,84.01 90 top
C15  18.18,56.23 0 top
C16  18.18,43.62 0 top
C17  69.12,80.99 90 top
C18  44.21,53.1 90 top
C19  31.2,56.28 180 top
C20  58.46,60.16 270 top
C21  42.9,59.7 90 top
C22  69.99,50.16 90 top
C23  57.21,42.81 270 top
C24  44.17,38.55 270 top
C25  69.28,8.58 270 top
C26  84.64,7.93 270 top
C27  70.04,42.85 90 top
C28  29.91,73.23 90 top
C29  31.2,23.8 270 top
C32  73.78,8.38 270 top
C33  31.2,29.7 0 top
C34  5.57,51.33 270 top
C35  70.06,57.41 90 top
C36  58.49,52.56 90 top
C37  45.21,45.89 270 top
C38  31.2,35.5 0 top
C39  73.4,43.8 90 top
C40  71.76,15.28 270 top
C41  37.7,39.2 0 top
D1  84.96,11.98 0 top
D2  76.33,43.58 90 top
D3  78.55,19.32 180 top
D4  84.69,54.94 180 top
D5  47.07,13.5 180 top
EEPROM  70.41,89.11 0 top
F1  84.9,14.6 0 top
GAIN  24.7,60 90 bottom
H1  10.7,96 0 top
H2  77.7,96 0 top
H3  MOUNT-HOLE2.8  [2,8]  62.6,5.5 0 top
H4  MOUNT-HOLE2.8  [2,8]  19.2,5.8 0 top
IC1  57.08,87.63 180 top
IC2  32.2,42.2 0 top
IC3  78.53,12.37 180 top
IC4  83.07,42.95 90 top
IC5  OPAMP-DUALU  [SO08']  50.6,42.79 270 top
IC6  OPAMP-DUALU  [SO08']  50.6,52.7 270 top
IN_JACK  11.08,30 180 top
JP1  54.8,62.8 0 top
K2  47.17,21.59 90 top
LED2  76.7,38 90 bottom
LSP1  37.59,14.42 0 top
LSP2  40.82,14.42 0 top
LSP3  83.22,17.4 0 top
LSP4  86.59,17.4 0 top
MOD1  50.7,60 270 bottom
MOD2  37.7,60 270 bottom
MOD3  63.7,60 270 bottom
OK2  56.78,19.55 0 top
OUT_JACK  77.3,30 0 top
PAD1  32.81,96.7 0 bottom
Q1  64.31,75.3 90 top
Q2  19.11,77.33 90 top
Q3  32.11,83.93 90 top
Q4  19.11,50.15 90 top
Q5  32.11,50.1 90 top
Q6  54.96,11.26 270 top
R1  63.62,62.74 0 top
R2  76.83,60.92 90 top
R3  76.68,51.12 90 top
R4  76.83,71.58 90 top
R5  50.54,30.78 180 top
R6  37.8,58.47 270 top
R7  37.7,41.78 0 top
R8  48.76,71.97 90 top
R9  40.2,58.47 90 top
R10  42.99,71.97 270 top
R11  37.7,47.42 180 top
R12  65.26,80.8 270 top
R13  22.7,63.5 90 top
R14  31.31,89.64 0 top
R15  18.16,96.61 0 top
R16  14.22,83.59 270 top
R17  24.16,79.06 180 top
R18  26.29,50.65 90 top
R19  23.33,50.65 270 top
R20  11.1,50.01 90 top
R21  30.79,79.06 180 top
R22  35.4,58.5 90 top
R23  57.28,46.9 0 top
R27  54.4,60.59 0 top
R29  42.6,46.14 90 top
R30  37.7,44.6 0 top
R31  24.78,40.4 0 top
R32  48.5,58.5 90 top
R34  24.9,23.2 180 top
R35  24.8,46.7 0 top
R36  24.8,44.1 0 top
R38  39.02,17.32 180 top
R41  54.98,6.96 0 top
R45  55,3.6 180 top
R46  49.72,8.38 270 top
S1  76.7,61 270 bottom
S2  76.7,50.5 270 bottom
S3  76.7,71.5 270 bottom
U2  32.31,11.93 270 top
U$1  56.31,72.39 180 top
U$2  55.96,56.99 90 top
U$3  55.88,51.28 270 top
U$4  19.48,92.53 90 top
U$5  16.94,92.13 270 top
U$6  29.84,64.81 270 top
U$7  32.44,65.2 90 top
U$8  12.7,15 0 top
U$11  RUMBLE OPTIONAL  [C1206']  11.1,58.4 270 top
U$17  [HOLD]  37.6,12.2 0 top
U$18  [HOLD]  40.8,12.2 0 top
U$19  [HOLD]  83.3,19.6 0 top
U$20  [HOLD]  86.5,19.6 0 top
U$23  RUMBLE OPTIONAL  [C1206']  37.7,51.1 180 top
VOL  11.7,60 90 bottom
VR1  63.73,52.79 270 top
~NUDEV~1  78.5,4.55 180 top

### Tracks (layer width: path | path; a pad name or v marks a point on that pad's centre or on a via)
2
  Top 0.203: K2.2 49.66,20.93 46.81,20.93 46.2,20.32 28.51,20.32 17.65,9.46 12.97,9.46 11.45,10.97 11.45,15.24 12.67,16.46 U$8.2B
+3V3
  Top 0.203: R12.1 65.3,82.3 67.94,82.3 68.76,83.11 69.37,83.11 70.18,82.3 70.18,81.08 69.16,80.06 C17.+ 69.16,79.86 69.16,78.03 70.18,77.01 70.18,68.89 | 70.18,68.89 73.63,68.89 S3.4 73.84,69.09 74.85,70.1 76.5,70.1 | 70.18,68.89 68.35,68.89 C11.1 68.15,69.09 65.91,69.09 65.1,69.9 63.47,69.9 61.64,71.73 | 76.5,70.1 76.68,70.1 R4.1 | R8.2 48.84,73.36 51.08,71.12 U$1.DVDD2 55.35,71.12 59.21,74.98 | 61.64,71.73 61.44,71.73 60.83,71.12 U$1.AVDD | 61.64,71.73 61.85,71.93 61.85,72.75 60.83,73.76 U$1.DVDD1 60.63,73.56 59.21,74.98 | 59.21,74.98 59.21,81.28 59.82,81.89 61.44,81.89 63.27,83.72 63.27,86.36 63.07,86.56 60.43,86.56 59,85.14 IC1.8 | 61.85,31.7 61.85,30.68 ANTI-HISS2.1 | 61.85,31.7 65.5,35.36 MOD3.3 65.58,35.73 69.75,39.91 72.71,39.91 73.76,40.95 | 61.85,31.7 57.17,31.7 53.52,35.36 52.7,35.36 MOD1.3 49.1,35.4 46.7,33 41.9,33 41.9,33.08 MOD2.3 | 77.7,41.86 77.29,42.27 77.29,43.89 76.48,44.7 D2.A 76.27,44.91 76.27,45.52 73.84,47.95 S2.4 73.84,48.16 75.26,49.58 76.48,49.58 R3.1 76.68,49.78 77.9,51 77.9,53.44 76.88,54.46 76.88,59.33 R2.1 | 77.7,41.86 78.71,40.84 81.15,40.84 85.42,45.11 86.03,45.11 IC4.3 | R2.1 76.68,59.33 74.65,59.33 73.84,58.52 S1.4 | 80.15,66.05 78.1,64.01 78.1,60.76 76.88,59.54 R2.1 | 80.15,66.05 81.35,67.26 81.35,74.37 76.4,79.33 76.4,85.31 77.9,86.81 77.9,89 EEPROM.4 | 73.76,40.95 76.79,40.95 77.7,41.86 | C39.1 73.4,41.31 73.76,40.95 | 80.15,66.05 76.5,69.7 76.5,70.1
+5V
  Top 0.203: 34.21,8.4 U2.8 34.21,8.33 33.6,8.94 33.6,9.14 32.99,9.75 29.74,9.75 | D5.C 49.45,13.61 49.45,17.48 49.66,17.68 K2.1 49.86,17.88 56.56,17.88 | C25.+ 69.37,9.75 73.63,9.75 C32.1 73.84,9.96 73.84,16.46 | D3.A 77.09,19.3 76.27,18.49 76.27,17.27 IC3.2 76.07,17.07 75.46,16.46 73.84,16.46 | 73.84,16.46 71.8,16.46 C40.+ 70.53,16.27 68.21,18.59 57.89,18.59 57.17,17.88 56.56,17.88 | 38.28,17.27 37.67,17.27 R38.2 37.46,17.27 30.55,17.27 29.74,16.46 29.74,9.75 | 29.74,9.75 26.08,6.1 26.08,4.27 ATTINY.1 26.08,4.06 27.3,2.85 27.3,2.64 28.52,1.42 39.29,1.42 43.76,5.89 50.87,5.89 52.5,7.52 52.5,8.94 55.14,11.58 55.35,11.58 56.56,12.8 56.56,17.88
+18V  (via drill 0.3)
  Top 0.203: D4.C 85.83,54.86 85.83,50.39 85.62,50.19 C10.+ 85.62,49.99 87.65,47.95 87.65,42.06 86.23,40.64 IC4.1 86.03,40.44 86.03,27.03 79.93,20.93 79.93,19.51 D3.C 79.93,19.3 80.75,18.49 80.75,17.27 IC3.1 80.95,17.07 83.39,14.63 F1.1 83.59,14.43 83.59,11.99 D1.C 83.79,11.79 84.61,10.97 84.61,8.94 C26.+ | 30.96,45.92 31.37,45.52 31.37,44.91 IC2.7 | 30.96,45.92 30.35,46.53 26.29,46.53 R35.2 26.22,49.16 R18.1 26.49,49.17 27.1,49.17 | 70.18,41.56 C27.1 | 76.27,42.27 D2.C 75.55,42.31 74.41,43.45 72.04,43.45 C27.1 | 53.31,54.66 IC6.8 | C27.1 69.98,41.56 | IC6.8 53.11,54.46 52.5,54.46 IC6.8 | 30.96,45.92 34.62,49.58 34.62,52.39 35.4,53.17 v35.4,55.6 R22.1 35.8,57.48 | 70.39,41.81 C27.1 | IC6.8 52.5,53.9 52,53.9 51.85,53.75 51.85,51.66 51.9,51.61 51.9,51.3 51.94,51.3 52,51.36 54.42,51.36 54.57,51.21 54.57,50.39 54.42,50.24 53.26,50.24 53.11,50.09 53.11,44.7 IC5.8 54.5,44.7 v55.1,45.3 | IC6.8 53.21,55.09 v52.7,55.6
  Bottom 0.203: C10.+ 85.42,49.99 85.42,49.17 78.92,42.67 76.68,42.67 76.48,42.47 D2.C | 76.07,42.67 76.27,42.47 D2.C | 76.07,42.67 61.24,42.67 58.61,45.3 v55.1,45.3 | 76.07,42.67 D2.C | v52.7,55.6 v35.4,55.6
CIRCUIT_IN
  Top 0.203: 49.05,30.89 R5.2 | 49.66,23.37 K2.3 51.37,24.74 51.48,24.74 51.62,24.89 51.62,28.27 R5.2 | 44.7,29.46 47.83,29.46 49.05,30.68 R5.2 | 44.7,29.46 44.37,29.46 | C1.1 44.7,29.46
CIRCUIT_OUT  (via drill 0.3)
  Top 0.203: 44.37,25.4 K2.5
  Top 0.254: v41.3,25.6 44.17,25.6 44.37,25.4
  Bottom 0.254: VOL.2 22.97,25.6 30.25,25.6 30.41,25.75 31.99,25.75 32.15,25.6 v41.3,25.6
FRMBUFF
  Top 0.203: U$8.3A 15.92,13.61 16.74,13.61 26.29,23.16 R34.1 26.72,22.8 C29.-
FV-1_SW_1  (via drill 0.3)
  Top 0.203: 51.69,80.06 U$1.S0 52.79,80.01 v53.3,79.5 | R2.2 76.88,62.38 76.88,63.4 73.84,63.4 S1.6
  Bottom 0.203: v53.3,79.5 54.2,78.6 70.7,78.6 74.35,74.95 74.74,74.95 75.28,74.42 75.28,68.58 73.7,67.01 S1.6
FV-1_SW_2  (via drill 0.3)
  Top 0.203: v53.11,78.03 52.5,78.64 51.89,78.64 U$1.S1 | R3.2 76.48,52.63 74.24,52.63 73.84,53.03 S2.6
  Bottom 0.203: v53.11,78.03 53.11,77.22 71.6,58.73 71.6,55.88 73.84,53.65 73.84,53.24 S2.6
FV-1_SW_3  (via drill 0.3)
  Top 0.203: v54.33,77.42 51.89,77.42 U$1.S2 | R4.2 76.68,73.15 74.65,73.15 73.84,73.97 S3.6
  Bottom 0.203: v54.33,77.42 69.57,77.42 72.82,74.17 73.63,74.17 S3.6
GND1  (via drill 0.3)  (1 unrouted)
  Top 0.203: U$1.REFN 51.89,68.68 51.89,69.7 U$1.GND5 | 60.63,68.68 60.22,69.09 60.02,69.09 59.61,69.49 59.61,69.9 | 59.61,69.9 59.61,71.53 60.63,72.54 U$1.GND2 | 59.61,66.85 59.82,66.65 63.88,66.65 65.3,65.23 C7.1 65.5,65.02 69.57,65.02 73.63,60.96 S1.5 | 59.61,66.85 59.61,67.67 60.63,68.68 | 60.63,68.68 U$1.GND1 | 59.61,69.9 51.89,69.9 U$1.GND5 | C6.- 46,73.56 46.4,73.56 48.23,71.73 49.66,71.73 51.69,69.7 U$1.GND5 | 59.61,66.85 59.61,65.43 57.79,63.61 57.44,63.26 56.98,62.8 JP1.3 | 53.92,24.59 55.35,23.16 OK2.4 55.55,23.16 59.61,27.23 61.64,27.23 ANTI-HISS2.2 | 53.92,24.59 53.49,25.02 53.49,29.68 R5.1 51.89,30.89 | 53.92,24.59 51.69,22.35 47.67,22.35 46.18,23.84 42.34,23.84 | U$1.GND4 53.92,76.2 55.95,78.23 | 55.95,78.23 57.58,79.86 57.58,84.94 IC1.7 | 26.29,44.09 R36.2 26.29,44.3 26.49,44.5 27.92,44.5 v27.92,44.3 29.54,44.3 | 68.35,71.32 68.35,73.15 69.16,73.97 C12.2 69.16,74.17 69.16,77.42 68.15,78.44 68.15,81.08 68.96,81.89 C17.- | 68.35,71.32 68.35,70.92 C11.2 68.35,71.32 | 68.35,71.32 64.49,71.32 C3.- | 34.01,39.42 35.03,38.41 | 35.03,38.41 35.43,38 37.26,38 38.28,39.01 39.09,39.01 C41.2 39.29,39.01 | IC1.1 58.8,90.22 57.78,90.22 IC1.2 57.58,90.22 56.56,90.22 IC1.3 56.36,90.22 55.35,90.22 IC1.4 55.14,90.22 55.14,87.58 52.7,85.14 MOD1.1 52.5,84.94 50.87,83.31 50.87,80.67 53.52,80.67 55.95,78.23 | U$1.GND3 60.83,77.62 60.83,78.64 U$1.T1 60.63,78.84 60.22,79.25 60.02,79.25 59.61,79.65 59.61,80.47 59.82,80.67 61.64,80.67 64.08,83.11 64.08,83.52 65.5,84.94 MOD3.1 | 70.18,44.41 C27.2 | S2.5 73.63,50.39 72.01,48.77 72.01,46.22 C27.2 | R34.2 23.44,23.16 14.91,23.16 9.62,17.88 9.62,16.66 U$8.1B
  Top 0.203: 23.24,49.38 R19.2 19.18,45.07 19.18,43.48 C16.- | R17.2 22.63,79.25 22.63,79.65 19.79,82.5 16.74,82.5 15.92,81.69 15.92,72.54 17.14,71.32 C2.- | v11.25,57.91 11.25,56.9 U$11.2 | IC4.2 86.03,42.88 83.79,40.64 83.79,38.2 OUT_JACK.S | IC4.4 80.14,43.08 80.14,46.33 83.39,49.58 83.39,49.99 C10.- | 35.03,38.41 32.18,35.56 C38.- | 78.71,9.75 81.96,9.75 84.61,7.11 C26.- | 78.71,9.75 IC3.3 79.5,8.9 | ~NUDEV~1.GND 79.77,8.7 78.71,9.75 | ANTI-HISS1.2 38.61,23.84 42.34,23.84 | 48.03,50.8 IC6.4 48.64,50.8 50.67,52.83 50.67,56.08 54.73,60.15 54.73,61.57 54.94,61.77 55.35,61.77 55.82,62.24 JP1.3 | v42.34,23.77 42.34,23.84 | IC5.4 48.63,40.23 65.3,40.23 69.32,44.26 C27.2 | JP1.3 55.82,63.23 | C27.2 72.45,44.26 C39.2
  pour Bottom: 23.46,-0.5 23.46,14.73 29.03,20.3 72.8,20.3 74.73,22.23 74.73,40.64 76.84,40.64 76.9,40.7 79.17,40.64 79.17,0 90.34,0 90.34,97.86 87.2,101 2.7,101 -1.8,96.5 -1.8,3.5 2.2,-0.5
GND2  (via drill 0.3)
  Top 0.203: 30.35,15.72 U2.4 30.55,15.44 30.55,13.41 36.04,7.92 36.04,4.27 ATTINY.5 | v57.99,17.88 57.99,16.05 OK2.2 | C25.- 69.37,7.52 69.77,7.11 73.63,7.11 C32.2 74.8,6.99 ~NUDEV~1.GNDA | R41.1 53.72,7.11 53.72,8.74 54.94,9.96 Q6.1
  pour Bottom: 78.7,19 78.7,-0.5 23.96,-0.5 23.96,14.46 29.4,19.9 73.04,19.9 75.22,22.07 75.36,40.01 78.53,40.01 78.53,19
IN
  Top 0.203: 14.3,18.69 15.72,17.27 15.72,16.66 U$8.3B | 14.3,18.69 13.28,19.71 12.06,19.71 11.45,19.1 11.45,16.66 9.62,14.83 9.62,13.61 U$8.1A | 14.3,18.69 17.35,21.74 IN_JACK.T 24.43,21.89 25.27,22.72 25.27,24.21 25.42,24.36 27.23,24.36 27.78,23.8 34.32,23.8 36.15,25.63 40.55,25.63 41.07,26.16 49.05,26.16 K2.4
LEFT_IN
  Top 0.203: R1.1 62.05,62.79 58.6,62.79 C20.1
LEFT_OUT
  Top 0.203: U$1.LOUT 51.69,64.82 46.81,64.82 44.37,67.26 C8.+
N$1
  Top 0.203: R14.1 29.95,89.61 29.95,84.33 30.15,84.12 Q3.2 30.35,84.12 32.59,84.12 36.24,80.47 44.17,80.47 C5.+
N$2
  Top 0.203: U$1.POT0 51.89,74.98 53.31,74.98 58.8,80.47 58.8,82.09 61.64,84.94 MOD3.2
N$3
  Top 0.203: 37.84,59.95 R6.1 R9.2 | R9.2 40.1,60.35 | R9.2 40.2,61.36 C8.-
N$4
  Top 0.203: 12.27,61.16 11.25,60.15 U$11.1 | 12.27,61.16 14.09,62.99 14.09,82.09 R16.2 | 12.27,61.16 17.14,56.29 C15.+
N$5
  Top 0.203: 39.29,41.25 39.29,41.45 | 39.29,41.45 39.29,41.66 R7.2 39.29,41.45 | IC5.5 50.67,40.88 50.1,41.45 46.65,41.45 45.8,40.6 45.8,39.1 45.8,39 | 45.8,39 45.4,38.6 42.8,38.6 39.95,41.45 39.29,41.45 | C1.2 45.8,35.56 45.8,39
N$6
  Top 0.203: R10.2 43.15,70.51 43.15,66.65 43.36,66.45 44.58,66.45 45.39,65.63 45.39,62.38 C4.2
N$7
  Top 0.203: R10.1 43.15,73.56 43.15,77.22 44.17,78.23 C5.-
N$8
  Top 0.203: IC6.3 48.03,52.22 48.64,52.22 49.45,53.03 49.45,55.07 48.64,55.88 48.64,56.9 R32.1 48.44,57.1 47.42,58.12 45.19,58.12 44.37,57.3 42.95,57.3 42.9,57.25 C21.1 42.23,57.2 42.08,57.05 R9.1
N$10
  Top 0.203: IC6.2 48.03,53.44 48.03,54.46 IC6.1 48.03,54.66 45.59,57.1 C4.1
N$11
  Top 0.203: R15.2 19.58,96.52 19.58,93.88 U$4.A 19.58,93.67 30.76,93.67 35.47,88.97 | 35.47,88.97 35.63,88.8 | 35.47,88.97 35.5,88.97 35.67,88.8 50.8,88.8 53.64,91.64 78.12,91.64 79.22,90.54 79.22,86.02 78.12,84.92 78.12,84.16 79.7,82.59 ASYMETRICAL.5
N$12
  Top 0.203: R30.2 39.29,44.7 42.54,44.7 R29.1 42.75,44.7 43.97,44.7 45.19,43.48 C37.2 45.39,43.48 47.83,43.48 IC5.2
N$13
  Top 0.203: VR1.3 62.46,55.07 63.07,55.07 64.49,56.49 69.98,56.49 C35.+
N$14
  Top 0.203: U$1.POT1 51.67,73.47 50.33,73.47 50,73.8 50,74.8 45.59,79.15 45.59,81.28 43.36,83.52 37.26,83.52 35.84,84.94 MOD2.2
N$15
  Top 0.203: 20.6,72.54 24.66,72.54 ANTI-HISS.2 24.86,72.75 25.27,72.75 30.55,78.03 30.55,79.65 31.98,81.08 31.98,82.5 Q3.3 | 20.6,72.54 19.38,71.32 C2.+ | 20.6,72.54 19.18,73.97 19.18,76 Q2.1
N$16
  Top 0.203: R18.2 26.49,52.22 27.51,52.22 31.16,55.88 31.16,56.69 25.88,61.98 22.83,61.98 R13.1 22.63,61.98 19.99,61.98 19.18,61.16 C13.2 19.18,60.96 19.18,56.29 C15.- | 16.94,93.27 U$5.C 16.94,96.52 R15.1 16.82,96.61 18.16,97.94 27.1,97.94 35.84,89.2 49.45,89.2 52.3,92.05 79.5,92.05 79.7,91.85 ASYMETRICAL.4
  Bottom 0.203: ASYMETRICAL.6 79.7,80.05 78.12,81.62 78.12,82.38 79.7,83.95 ASYMETRICAL.4 | C13.2 20.6,62.51 20.6,76.8 20.6,76.9 20.6,77.11 Q2.3 17.59,78.61 15.6,80.6 15.6,92.06 U$5.C
N$17
  Top 0.203: R16.1 14.3,84.94 22.43,84.94 22.63,84.73 GAIN.3
N$18
  Top 0.203: Q3.1 32.18,85.34 32.59,85.75 32.59,89.61 R14.2 32.59,89.81 31.98,89.81 30.96,90.83 28.93,90.83 24.6,86.5 | R17.1 25.47,79.25 25.47,85.1 25.47,85.34 25.47,85.63 24.6,86.5 | C9.1 19.57,86.5 24.6,86.5
N$19
  Top 0.203: 51.69,72.54 U$1.POT2 52.53,73.05 52.68,73.05 52.88,73.25 52.88,74.32 51.05,74.32 50.9,74.47 50.9,75.74 48.83,77.81 MOD1.2
N$21
  Top 0.203: 39.09,48.16 39.09,47.55 R11.1 | IC6.5 53.11,50.8 49.75,50.8 49.19,50.24 46.06,50.24 C18.+ | 44.37,52.02 C18.+ | 39.09,48.16 40.31,48.16 44.17,52.02 C18.+ | 39.09,48.16 R11.1 | R11.1 39.12,50.87 U$23.1
N$22
  Top 0.203: 48.03,42.27 IC5.3 48.13,42 50.9,42 51.3,41.6 54.42,41.6 54.64,41.81 C23.-
N$23
  Top 0.203: 53.11,53.44 IC6.7 | 58.6,47.75 58.6,49.99 C36.1 58.39,49.99 55.95,52.43 U$3.C | 58.6,47.75 58.6,46.94 R23.2 | 58.6,47.75 69.98,47.75 C22.1 | 58.6,47.75 R23.2 | C23.+ 57.38,43.89 57.38,45.52 58.6,46.74 R23.2 | 52.5,53.24 53.11,53.24 IC6.7 | IC6.7 53.31,53.44 53.92,53.44 54.94,54.46 54.94,57.1 55.95,58.12 U$2.A
  Bottom 0.203: U$2.A 55.96,57.49 56.92,56.53 56.92,53.59 U$3.C
N$24
  Top 0.203: C35.- 69.98,58.52 67.77,60.73 55.96,60.73 R27.2
N$25
  Top 0.203: C16.+ 17.35,43.69 17.35,47.14 18.97,48.77 Q4.3 19.11,48.87 19.12,48.85 20.55,50.28 27.3,50.28 28.75,48.83 Q5.1
N$26
  Top 0.203: U$1.SCK 61.44,81.28 63.68,83.52 63.68,86.56 | 63.68,86.56 63.27,86.97 57.78,86.97 56.56,85.75 56.56,85.14 IC1.6 | 63.68,86.56 70.59,86.56 71.8,87.78 71.8,87.99 72.82,89 EEPROM.2
N$27
  Top 0.203: 44.58,47.75 42.75,47.75 R29.2 | 44.58,47.75 45.19,48.36 C37.1 | 47.83,44.7 44.78,47.75 44.58,47.75 | 47.83,44.7 IC5.1 | 47.83,44.7 48.55,43.98 49.19,43.98 49.34,43.84 49.34,43.02 49.19,42.87 46.64,42.87 45.39,41.62 45.39,40.78 C24.+
N$28
  Top 0.203: U$1.SDA 51.89,81.28 51.89,81.69 55.14,84.94 IC1.5 55.35,85.14 55.35,85.75 56.97,87.38 57.99,87.38 59.61,89 70.38,89 EEPROM.1
N$29
  Top 0.203: C34.2 5.76,48.77 11.05,48.77 R20.1 11.25,48.77 12.47,49.99 15.9,49.99 | 15.9,49.99 17.14,49.99 Q4.2 | 15.9,49.99 15.9,43.19 16.84,42.25 23.65,42.25 24.41,41.49 24.41,37.16 GAIN.2
N$30
  Top 0.203: U$1.LIN 60.83,64.82 61.07,65.06 C7.2 | 63.27,65.23 C7.2 | R1.2 64.89,62.79 64.89,63.6 63.47,65.02 C7.2
N$31
  Top 0.203: Q5.2 30.35,50.19 30.35,52.83 32.18,54.66 32.18,56.08 C19.+ 32.18,56.29 32.18,62.38 31.37,63.2 31.37,66.24 | 31.37,66.24 32.18,66.24 32.38,66.45 U$7.A | 31.37,66.24 29.95,66.24 | R21.2 29.54,79.25 29.54,81.48 31.77,83.72 32.38,83.72 33.4,82.7 33.4,74.37 29.95,70.92 C28.1 29.95,70.71 29.95,66.24 | 29.95,66.24 U$6.C
N$32
  Top 0.203: C14.2 16.94,86.56 U$5.A 16.94,91.03 17.14,91.24 19.38,91.24 U$4.C
N$33
  Top 0.203: U$1.MID 60.83,67.46 63.47,67.46 64.29,68.28 C3.+
N$34
  Top 0.203: F1.2 86.43,14.63 86.43,17.38 LSP4.MP
N$35
  Top 0.203: C34.1 5.76,53.65 7.8,51.61 11.05,51.61 R20.2 11.25,51.41 18.97,51.41 Q4.1 19.18,51.61 19.58,52.02 23.24,52.02 R19.1 23.44,52.22 27.3,56.08 30.15,56.08 C19.-
N$36  (via drill 0.3)
  Top 0.203: R31.2 27.52,39.08 27.91,39.01 28.2,38.73 v28.2,38.5
  Bottom 0.203: v28.2,38.5 29.15,37.55 C24.-
N$37
  Top 0.203: 52.67,60.88 R27.1 53.09,60.59 54.8,62.3 JP1.2
N$38
  Top 0.203: C22.2 69.98,52.63 67.94,50.6 63.88,50.6 VR1.2 63.68,50.6 62.86,50.6 58.6,54.86 C36.2 58.39,55.07 56.77,55.07 56.16,55.68 U$2.C 55.96,54.67 55.81,54.67 54.57,53.43 54.57,52.93 54.42,52.78 | R23.1 55.95,46.94 55.95,49.99 U$3.A 55.88,51.32 55.8,51.4 55.61,51.59 55.07,51.59 54.92,51.74 54.92,52.28 54.42,52.78 | 53.31,52.02 IC6.6 53.92,52.78 54.42,52.78
N$39
  Top 0.203: R35.1 23.44,46.53 23.44,44.3 R36.1 25.07,42.41 25.07,38 26.08,36.98 28.32,36.98 29.13,36.17 | 29.13,36.17 29.54,36.58 30.35,36.58 32.79,39.01 32.79,39.42 IC2.3 | 29.13,36.17 29.13,30.89 30.15,29.87 C33.+
N$40
  Top 0.203: 17.35,81.48 16.94,81.48 C14.1 17.35,81.48 | 17.35,81.48 19.38,81.48 C9.2 | 17.35,81.48 17.35,77.42 Q2.2 17.35,77.22 17.35,72.54 18.16,71.73 18.16,66.85 18.97,66.04 C13.1 19.18,65.84 19.99,65.02 22.63,65.02 R13.2 22.83,65.02 24.66,66.85 24.66,69.09 ANTI-HISS.1
N$41  (via drill 0.3)  (1 unrouted)
  Top 0.203: C29.+ 33.84,24.8 35.78,26.74 39.34,26.74 39.34,31.98 | 53.31,42.27 53.31,43.28 IC5.7 53.11,43.48 | 53.31,42.27 IC5.6 | 53.3,32 v54.5,33.2 | 53.31,42.27 56.35,42.27 56.83,42.74 59.26,42.74 v60.7,41.3 65.32,45.92 69.57,45.92 70.99,47.35 70.99,52.83 70.34,53.49 69.65,53.49 69.6,53.44 61.85,53.44 58.6,56.69 58.6,57.52 C20.2
  Bottom 0.203: v54.5,33.2 54.5,33.3 60.7,39.5 v60.7,41.3
N$43
  Top 0.203: 9.83,84.53 VOL.3 9.82,59.25 4.74,54.17 4.74,48.48 13.18,40.04 23,40.04 R31.1
N$46
  Top 0.203: U$1.REFP 51.69,67.46 51.28,67.87 51.08,67.87 48.84,70.1 48.84,70.51 R8.1 48.64,70.71 48.44,70.92 46,70.92 C6.+
N$51
  Top 0.203: R21.1 32.18,79.05 32.18,78.03 29.95,75.79 C28.2 29.74,75.59 29.74,71.93 28.73,70.92 28.73,64.62 29.74,63.6 U$6.A | 33.2,60.7 33.2,63.2 32.59,63.8 U$7.C | 33.2,60.7 33.2,55.07 32.18,54.05 32.18,51.41 Q5.3 | 44.17,54.05 C18.- | 33.2,60.7 34.62,60.7 R22.2
  Bottom 0.203: U$6.A 29.95,63.6 30.76,63.6 30.96,63.8 32.38,63.8 U$7.C | C18.- 44.17,54.05 43.36,54.05 41.73,52.43 33.4,52.43 32.18,51.21 Q5.3
N$52
  Top 0.203: U$1.T0 60.83,79.86 64.69,79.86 65.1,79.45 R12.2
N$53
  Top 0.203: U$1.X2 60.83,74.78 63.07,74.78 64.29,73.56 Q1.P$2 64.49,73.56 64.89,73.97 67.13,73.97 C12.1
N$54
  Top 0.203: U$1.X1 63.47,76.2 64.29,77.01 Q1.P$1
N$59
  Top 0.203: 12.76,13.5 U$8.2A 12.7,12.5 15.1,10.1 17.1,10.1 27.99,20.99 K2.7
N$74
  Top 0.203: 30.55,8.2 U2.5 30.55,8.13 30.55,4.67 30.96,4.27 ATTINY.3
N$75
  Top 0.203: 31.57,8.4 U2.6 31.57,8.33 30.96,8.94 30.96,9.14 30.76,9.35 29.95,9.35 28.73,8.13 28.73,4.27 ATTINY.2 28.52,4.06 30.76,1.83 39.09,1.83 44.17,6.91 49.66,6.91 R46.2 49.66,7.11
N$76
  Top 0.203: 32.99,8.2 U2.7 32.99,8.13 32.99,4.88 33.6,4.27 ATTINY.4
N$77
  Top 0.203: 34.21,15.51 U2.1 34.42,15.65 36.85,15.65 37.06,15.85 38.07,15.85 39.09,14.83 39.09,4.47 38.89,4.27 ATTINY.6
N$78
  Top 0.203: R38.1 40.51,17.48 41.73,17.48 44.17,19.91 73.92,19.91 74.7,20.7 76.3,22.6 76.3,36.33 LED2.A
N$79
  Top 0.203: Q6.3 54.94,12.39 54.53,12.39 50.47,8.33 48.84,8.33 44.98,12.19 44.98,13.41 D5.A 44.98,13.61 44.98,17.88 K2.8 47.12,17.79 48.44,19.1 74.62,19.1 77.7,22.17 77.7,38.27 LED2.K
N$84
  Top 0.203: Q6.2 56.77,11.18 56.77,7.32 56.56,7.11 R41.2 56.56,6.91 56.56,3.77 R45.1
N$85  (via drill 0.3)
  Top 0.203: 32.99,15.51 U2.2 32.99,15.44 32.99,14.63 v38.48,9.14 | v43.15,4.47 52.7,4.47 53.52,3.66 R45.2
  Bottom 0.203: v43.15,4.47 v38.48,9.14
N$87
  Top 0.203: 31.77,15.72 U2.3 31.77,15.65 31.77,16.05 32.38,16.66 33.4,16.66 33.6,16.46 33.6,14.83 34.01,14.43 37.46,14.43 LSP1.MP
N$88
  Top 0.203: R46.1 49.86,9.96 49.86,10.36 55.35,15.85 OK2.1
OUT
  Top 0.203: K2.6 44.58,23.16 45.79,21.95 51.28,21.95 51.89,21.34 56.36,21.34 57.99,22.96 OK2.3 58.19,23.16 59.61,23.16 70.79,34.34 70.79,38 OUT_JACK.T
VB
  Top 0.203: 36.45,41.05 36.45,41.66 R7.1 | 36.45,41.05 36.45,39.22 C41.1 | 36.45,41.05 33.4,41.05 | 33.4,41.05 32.38,41.05 31.57,40.23 31.57,39.62 IC2.2 | 36.45,41.05 R7.1 | 30.35,35.36 30.35,31.29 31.16,30.48 31.16,28.65 33.7,28.65 33.81,28.65 36.7,28.65 | 33.4,41.05 33.4,38.41 30.35,35.36 | 30.35,35.36 C38.+ | R11.2 36.45,47.35 36.45,44.7 R30.1 R7.1 | 35.63,48.16 36.24,47.55 R11.2 | 35.63,48.16 32.99,45.52 32.99,44.91 IC2.6 32.79,44.7 32.79,44.09 | 35.63,48.16 R11.2 | 42.75,62.1 42.75,62.18 C21.2 42.75,61.77 | 42.75,62.1 42.75,61.77 | R6.2 37.18,57.46 | 42.75,61.77 44.58,59.94 48.44,59.94 R32.2 | R32.2 48.52,59.94 | R32.2 48.72,59.92 51.6,62.8 JP1.1 | 36.7,28.65 37.1,28.65 ANTI-HISS1.1 | 36.7,28.65 36.7,31.78 | R6.2 36.85,56.1 36.85,51.91 U$23.2 35.99,51.16 35.83,51.16 35.83,50.83 36.28,50.39 R11.2 | R6.2 38.6,57.84 38.6,58.4 39.04,58.84 41.21,58.84 41.36,58.98 41.36,61.16 42.3,62.1 42.75,62.1

### Text on the board
tPlace: BUILT BY: | DATE: | extra board here | Goldtooth | GOLDTOOTH FZZSHAPE V3
_bPlace: MOD1 | U$8 | MOD2 | MOD3
_tNames: C23 | C17 | C8 | C12 | D2 | D1 | C7 | Q4 | Q3 | R24 | C10 | C6 | C3 | Q1 | K2 | D4 | R6 | C11 | R12 | R8 | R4 | R3 | R2 | R1 | R22 | R19 | R18 | R17 | R16 | R13 | R10 | LED2 | C24 | J1 | C30 | C32 | C31 | C21 | R9 | R7 | R5 | C9 | R21 | R20 | R15 | R14 | C28 | C13 | C29 | C20 | R23 | R46 | C4 | R11 | C14 | C1 | C19 | C18 | C16 | C15 | C5 | C2 | U$7 | LSP3 | OK2 | LSP2 | LSP4 | U$3 | Q6 | LSP1 | C22 | Q5 | Q2 | VR1 | U$6 | U$5 | U$4 | ASYMETRICAL | C27 | U$2 | R25 | C26 | C25 | S4 | IC3 | D3 | R26 | U2 | R38 | R41 | R45 | S2 | R35 | C33 | S3 | IC4 | IC2 | S1 | IC1
_tDocu: OUT_JACK | IN_JACK